# Altium schematic sheet Power_Stage.SchDoc
size A2; SheetNumber: 4; SheetTotal: 5
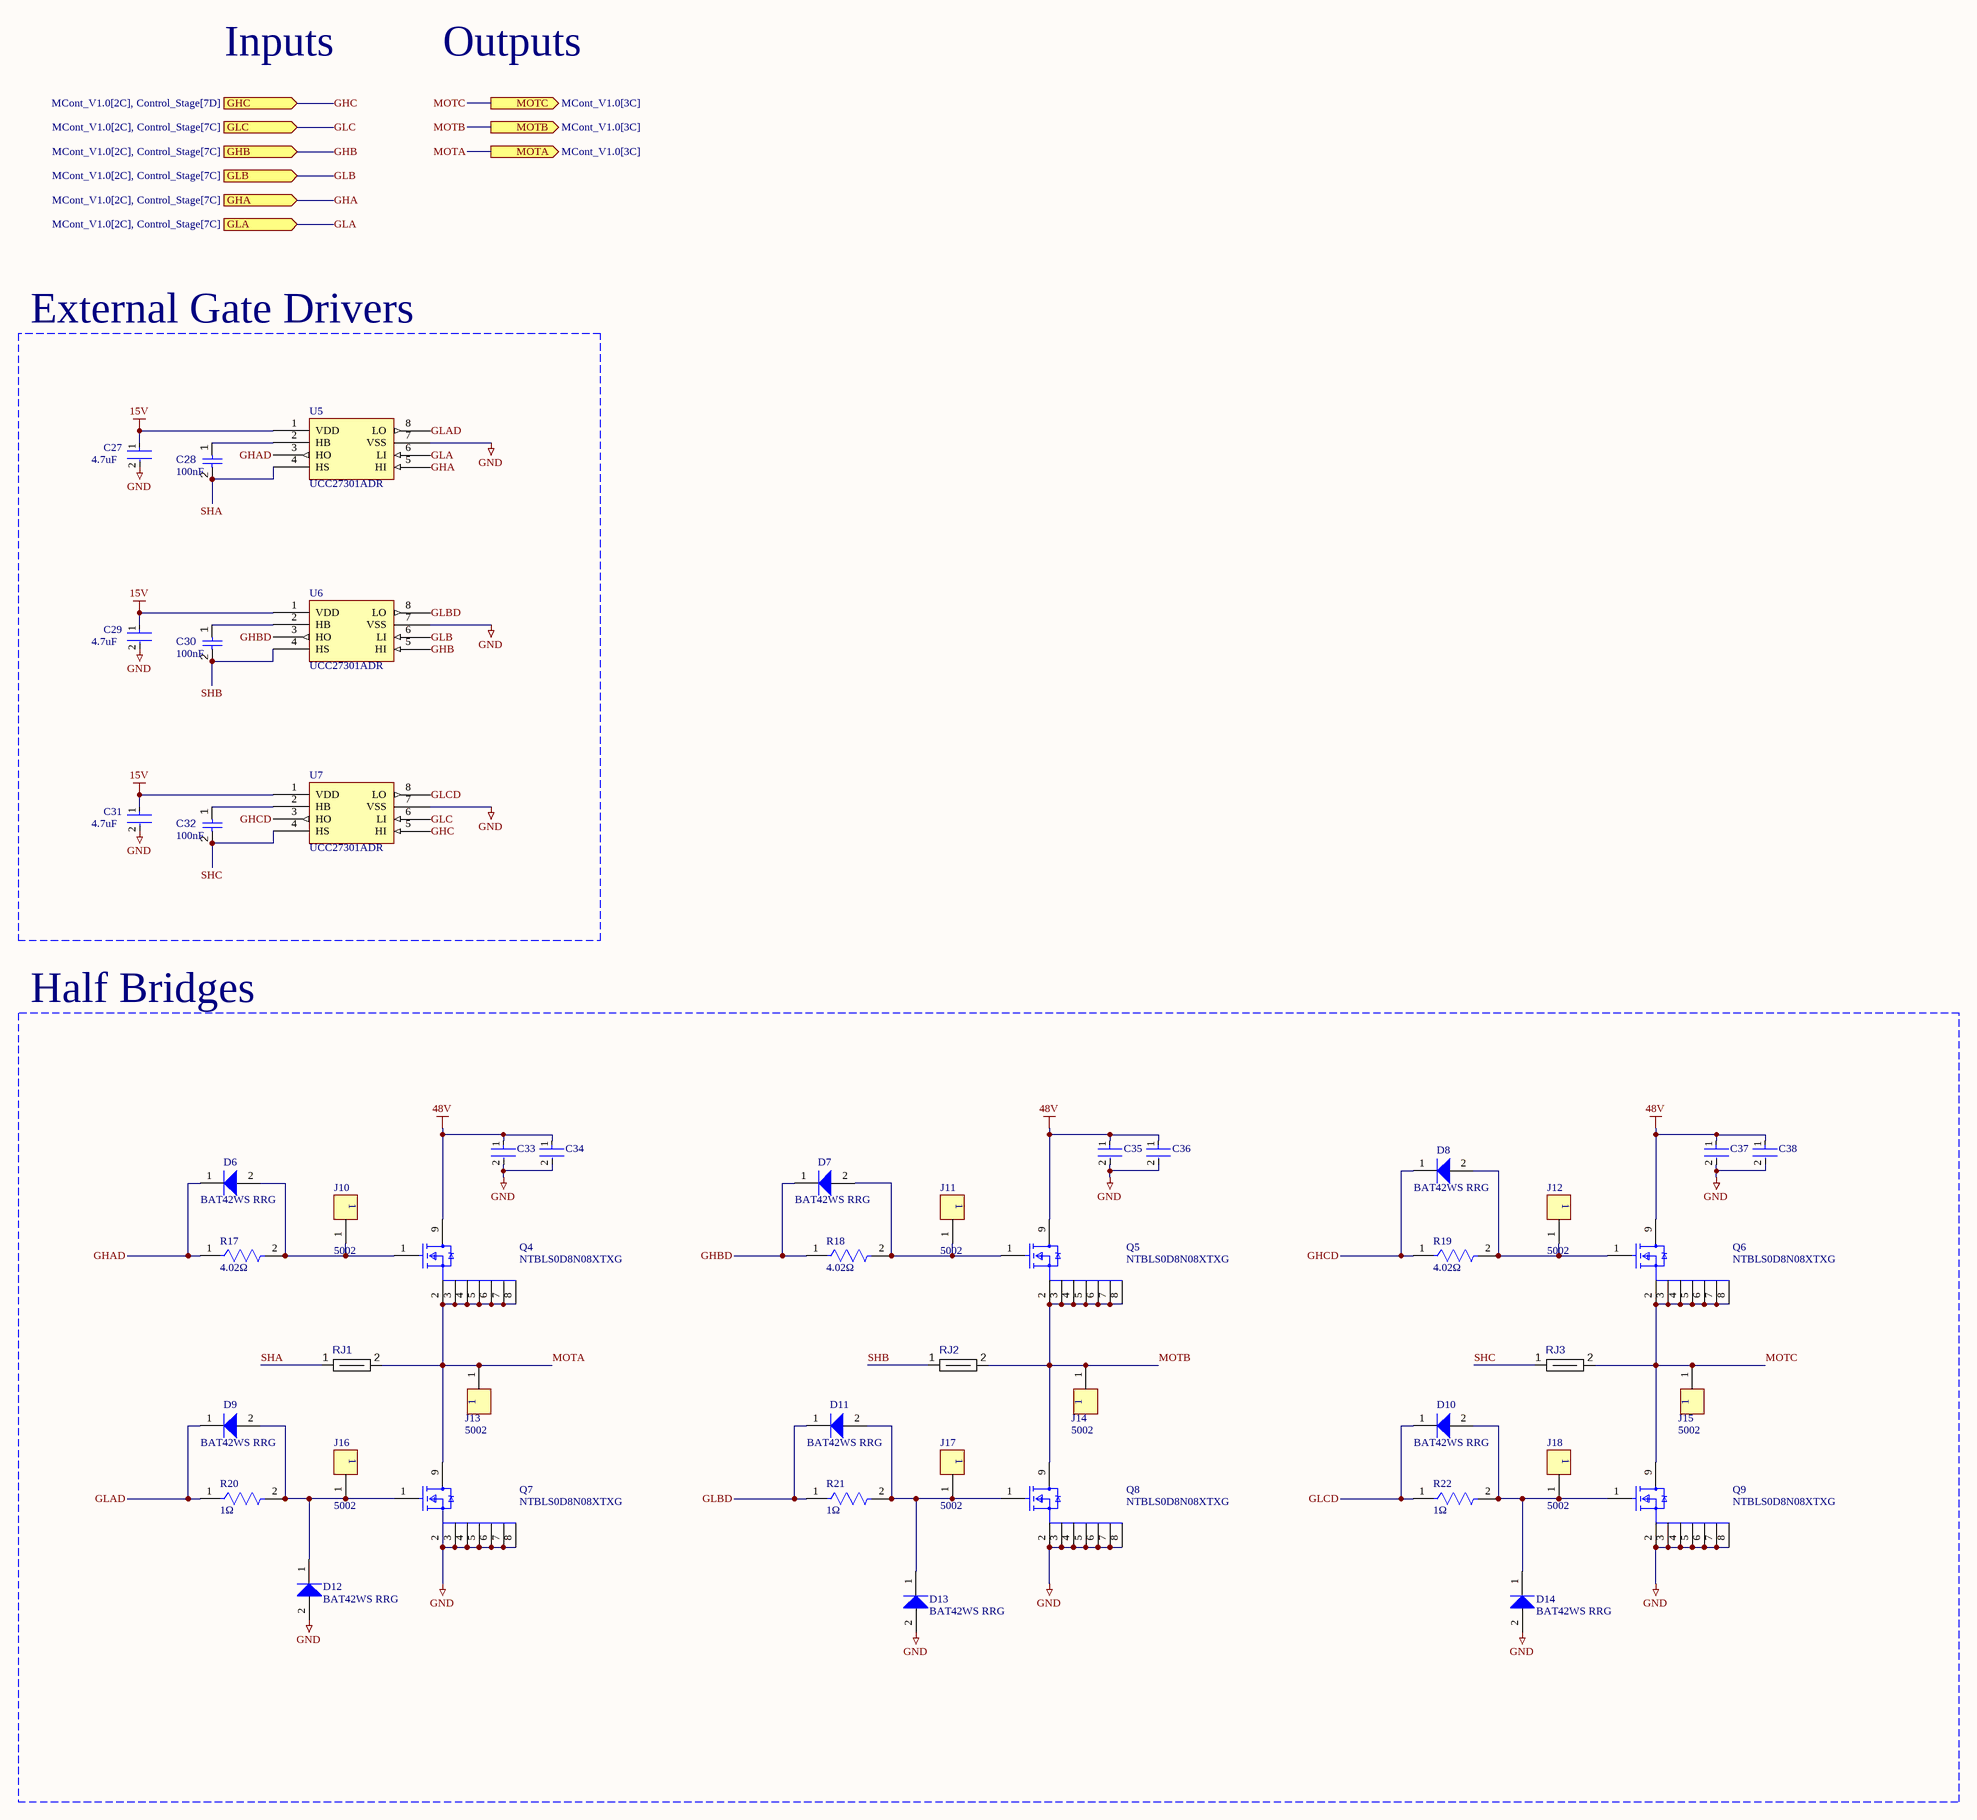
[diagram p0: Power_Stage.SchDoc]

## Parts
C27  Capacitance: 4.7uF  [FP-CL21-IPC_A]  (hidden comment: CL21A475KAQNNNE)
C28  value 100nF  [FP-CL10-IPC_B]  (hidden comment: CL10B104KC8NNNC)
C29  Capacitance: 4.7uF  [FP-CL21-IPC_A]  (hidden comment: CL21A475KAQNNNE)
C30  value 100nF  [FP-CL10-IPC_B]  (hidden comment: CL10B104KC8NNNC)
C31  Capacitance: 4.7uF  [FP-CL21-IPC_A]  (hidden comment: CL21A475KAQNNNE)
C32  value 100nF  [FP-CL10-IPC_B]  (hidden comment: CL10B104KC8NNNC)
C33  C1210C105K1RACTU  [FP-C1210C105K1RACTU-MFG]  (value not drawn)
C34  C1210C105K1RACTU  [FP-C1210C105K1RACTU-MFG]  (value not drawn)
C35  C1210C105K1RACTU  [FP-C1210C105K1RACTU-MFG]  (value not drawn)
C36  C1210C105K1RACTU  [FP-C1210C105K1RACTU-MFG]  (value not drawn)
C37  C1210C105K1RACTU  [FP-C1210C105K1RACTU-MFG]  (value not drawn)
C38  C1210C105K1RACTU  [FP-C1210C105K1RACTU-MFG]  (value not drawn)
D6  BAT42WS RRG  [BAT42WS RRG-Footprint-1]
D7  BAT42WS RRG  [BAT42WS RRG-Footprint-1]
D8  BAT42WS RRG  [BAT42WS RRG-Footprint-1]
D9  BAT42WS RRG  [BAT42WS RRG-Footprint-1]
D10  BAT42WS RRG  [BAT42WS RRG-Footprint-1]
D11  BAT42WS RRG  [BAT42WS RRG-Footprint-1]
D12  BAT42WS RRG  [BAT42WS RRG-Footprint-1]
D13  BAT42WS RRG  [BAT42WS RRG-Footprint-1]
D14  BAT42WS RRG  [BAT42WS RRG-Footprint-1]
J10  5002  [FP-5002-MFG]
J11  5002  [FP-5002-MFG]
J12  5002  [FP-5002-MFG]
J13  5002  [FP-5002-MFG]
J14  5002  [FP-5002-MFG]
J15  5002  [FP-5002-MFG]
J16  5002  [FP-5002-MFG]
J17  5002  [FP-5002-MFG]
J18  5002  [FP-5002-MFG]
Q4  NTBLS0D8N08XTXG  [NTBLS0D8N08XTXG]
Q5  NTBLS0D8N08XTXG  [NTBLS0D8N08XTXG]
Q6  NTBLS0D8N08XTXG  [NTBLS0D8N08XTXG]
Q7  NTBLS0D8N08XTXG  [NTBLS0D8N08XTXG]
Q8  NTBLS0D8N08XTXG  [NTBLS0D8N08XTXG]
Q9  NTBLS0D8N08XTXG  [NTBLS0D8N08XTXG]
R17  value 4.02Ω  [CRCW06034R02FKEAHP-Footprint-1]  (hidden comment: CRCW06034R02FKEAHP)
R18  value 4.02Ω  [CRCW06034R02FKEAHP-Footprint-1]  (hidden comment: CRCW06034R02FKEAHP)
R19  value 4.02Ω  [CRCW06034R02FKEAHP-Footprint-1]  (hidden comment: CRCW06034R02FKEAHP)
R20  value 1Ω  [SR0603FR-7T1RL-Footprint-1]  (hidden comment: SR0603FR-7T1RL)
R21  value 1Ω  [SR0603FR-7T1RL-Footprint-1]  (hidden comment: SR0603FR-7T1RL)
R22  value 1Ω  [SR0603FR-7T1RL-Footprint-1]  (hidden comment: SR0603FR-7T1RL)
RJ1  Net Tie 30x70mil  [Net Tie 10x20mil-Footprint-1]  (value not drawn)  (net tie, no BOM)
RJ2  Net Tie 30x70mil  [Net Tie 10x20mil-Footprint-1]  (value not drawn)  (net tie, no BOM)
RJ3  Net Tie 30x70mil  [Net Tie 10x20mil-Footprint-1]  (value not drawn)  (net tie, no BOM)
U5  UCC27301ADR  [SOIC127P600X175-8N]
U6  UCC27301ADR  [SOIC127P600X175-8N]
U7  UCC27301ADR  [SOIC127P600X175-8N]

## Blocks framed on the sheet
External Gate Drivers: C27-C32 U5-U7
Half Bridges: C33-C38 D6-D14 J10-J18 Q4-Q9 R17-R22 RJ1-RJ3

## Ports
GHA (in, see MCont_V1.0[2C], Control_Stage[7C]), GHB (in, see MCont_V1.0[2C], Control_Stage[7C]), GHC (in, see MCont_V1.0[2C], Control_Stage[7D]), GLA (in, see MCont_V1.0[2C], Control_Stage[7C]), GLB (in, see MCont_V1.0[2C], Control_Stage[7C]), GLC (in, see MCont_V1.0[2C], Control_Stage[7C]), MOTA (out, see MCont_V1.0[3C]), MOTB (out, see MCont_V1.0[3C]), MOTC (out, see MCont_V1.0[3C])

## Nets
15V: C27.1 C29.1 C31.1 U5.1(VDD) U6.1(VDD) U7.1(VDD)
48V: C33.1 C34.1 C35.1 C36.1 C37.1 C38.1 Q4.9(Drain) Q5.9(Drain) Q6.9(Drain)
GND: C27.2 C29.2 C31.2 C33.2 C34.2 C35.2 C36.2 C37.2 C38.2 D12.2(A) D13.2(A) D14.2(A) Q7.2(Source) Q7.3(Source) Q7.4(Source) Q7.5(Source) Q7.6(Source) Q7.7(Source) Q7.8(Source) Q8.2(Source) Q8.3(Source) Q8.4(Source) Q8.5(Source) Q8.6(Source) Q8.7(Source) Q8.8(Source) Q9.2(Source) Q9.3(Source) Q9.4(Source) Q9.5(Source) Q9.6(Source) Q9.7(Source) Q9.8(Source) U5.7(VSS) U6.7(VSS) U7.7(VSS)
GHA: U5.5(HI) ; port GHA
GHAD: D6.1(K) R17.1 U5.3(HO)
GHB: U6.5(HI) ; port GHB
GHBD: D7.1(K) R18.1 U6.3(HO)
GHC: U7.5(HI) ; port GHC
GHCD: D8.1(K) R19.1 U7.3(HO)
GLA: U5.6(LI) ; port GLA
GLAD: D9.1(K) R20.1 U5.8(LO)
GLB: U6.6(LI) ; port GLB
GLBD: D11.1(K) R21.1 U6.8(LO)
GLC: U7.6(LI) ; port GLC
GLCD: D10.1(K) R22.1 U7.8(LO)
MOTA: J13.1 Q4.2(Source) Q4.3(Source) Q4.4(Source) Q4.5(Source) Q4.6(Source) Q4.7(Source) Q4.8(Source) Q7.9(Drain) RJ1.2 ; port MOTA
MOTB: J14.1 Q5.2(Source) Q5.3(Source) Q5.4(Source) Q5.5(Source) Q5.6(Source) Q5.7(Source) Q5.8(Source) Q8.9(Drain) RJ2.2 ; port MOTB
MOTC: J15.1 Q6.2(Source) Q6.3(Source) Q6.4(Source) Q6.5(Source) Q6.6(Source) Q6.7(Source) Q6.8(Source) Q9.9(Drain) RJ3.2 ; port MOTC
SHA: C28.2 RJ1.1 U5.4(HS)
SHB: C30.2 RJ2.1 U6.4(HS)
SHC: C32.2 RJ3.1 U7.4(HS)
NetC28_1: C28.1 U5.2(HB)
NetC30_1: C30.1 U6.2(HB)
NetC32_1: C32.1 U7.2(HB)
NetD6_2: D6.2(A) J10.1 Q4.1(Gate) R17.2
NetD7_2: D7.2(A) J11.1 Q5.1(Gate) R18.2
NetD8_2: D8.2(A) J12.1 Q6.1(Gate) R19.2
NetD9_2: D9.2(A) D12.1(K) J16.1 Q7.1(Gate) R20.2
NetD10_2: D10.2(A) D14.1(K) J18.1 Q9.1(Gate) R22.2
NetD11_2: D11.2(A) D13.1(K) J17.1 Q8.1(Gate) R21.2

## Notes on the sheet
- Inputs
- Outputs

## Library data of the parts
C27 C29 C31 = CMP-13271-002624-1: CL21 Series 0805 4.7uF 25V ±10% Tolerance X5R Multilayer Ceramic Chip Capacitor; Case Code (Imperial): 0805; Thickness: 0.055inch; Mount: Surface Mount; Case Code (Metric): 2012; Depth: 1.25mm; Lead Free: Lead Free; Case/Package: 0805; Voltage Rating: 25V; Package Quantity: 1; Width: 0.049inch; Radiation Hardening: No; Voltage Rating (DC): 25V; Length: 2mm; Dielectric: X5R; Height: 1.25mm; Packaging: Tape and Reel; Tolerance: 10%; Min Operating Temperature: -55°C; Max Operating Temperature: 85°C
C28 C30 C32 = CMP-001-00090-1: Ceramic Capacitor, Multilayer, Ceramic, 100V, 10% +Tol, 10% -Tol, X7R, 15% TC, 0.1uF, Surface Mount, 0603; Case/Package: 0603; Min Operating Temperature: -55°C; Mounting Technology: Surface Mount; Capacitor Type: Ceramic; Max Operating Temperature: 125°C; Pins: 2; RoHS Compliant: Yes
C33-C38 = CMP-03020-034669-1: CAP CER 1UF 100V X7R 1210; Dielectric Material: Ceramic; Tolerance: 10%; Capacitance: 1uF; Height: 1.7mm; Voltage Rating: 100V; Termination: SMD/SMT; Depth: 2.5mm; Construction: Flat; REACH SVHC: No SVHC; Length: 3.2mm; Case Code (Imperial): 1210; Radiation Hardening: No; Case/Package: 1210; Case Code (Metric): 3225; Mount: Surface Mount; Package Quantity: 1; Voltage Rating (DC): 100V; Min Operating Temperature: -55°C; Voltage: 100V; Thickness: 0.075inch; Width: 0.098inch; Max Operating Temperature: 125°C; Packaging: Tape and Reel; Series: C; RoHS Compliant: Yes; Number of Pins: 2; Dielectric: X7R
D6-D14 = CMP-004-00032-1: Schottky Diode, 30V, 0.2A, Sod-323F Rohs Compliant: Yes; Manufacturer Lifecycle Status: ACTIVE; Lifecycle Status: Production
J10-J18 = CMP-2000-05182-2: PC TEST POINT MINIATURE WHITE; Body Material: Bronze; Insulation: Insulated; Inside Diameter: 1.27mm; Number of Ports: 1; Outside Diameter: 2.54mm; Hole Diameter: 1.6mm; Plating: Silver; Contact Plating: Silver; Orientation: Straight; REACH SVHC: No SVHC; Series: THM; Packaging: Bulk; Material: Nylon; Flammability Rating: UL94 V-0; Mount: Through Hole; Color: White; Housing Color: White; Length: 7.62mm; Contact Material: Bronze; Lead Free: Lead Free; Package Quantity: 100; RoHS Compliant: Yes
Q4-Q9 = CMP-013-00034-1: NTBL Series N-Channel 457A 325W Surface Mount Power Mosfet HPSOF-8; Manufacturer Lifecycle Status: ACTIVE; Lifecycle Status: Production; REACH SVHC: No; RoHS: Compliant
R17-R19 = CMP-009-00185-1: Res Thick Film 0603 4.02 Ohm 1% 0.33W(1/3W) ±100ppm/C Pad SMD Automotive T/R; Max Power Dissipation: 250mW; Voltage Rating: 75V; Power Dissipation: 330mW; Temperature Coefficient: 100ppm/°C; Tolerance: 1%; Packaging: Tape & Reel (TR); Number of Terminals: 2; Composition: Thick Film; REACH SVHC: Yes; Mounting Technology: Surface Mount; Lifecycle Status: Production; Length: 1.6002mm; Features: Automotive AEC-Q200; China RoHS: Non-Compliant; Export Control Classification Number (ECCN) Code: EAR99; Power Rating: 330mW; Introduction Date: 2008-07-29; Min Operating Temperature: -55°C; Harmonized Tariff Schedule (HTS) Code: 8533.21.00.30; Case Code (Metric): 1608; Height: 450µm; RoHS: Compliant; Case Code (Imperial): 0603; Contact Plating: Tin; Working Voltage: 75V; Case/Package: 0603; Number of Terminations: 2; Radiation Hardening: No; Lead Free: Lead Free; Width: 850µm; Max Operating Temperature: 155°C; Schedule B: 8533210045, 8533210045
R20-R22 = CMP-009-00184-1: Res Thick Film 0603 1 Ohm 1% 0.25W(1/4W) ±200ppm/C Pad SMD Automotive T/R; Working Voltage: 150V; Power Dissipation: 250mW; Temperature Coefficient: 200ppm/°C; Export Control Classification Number (ECCN) Code: EAR99; Harmonized Tariff Schedule (HTS) Code: 8533.21.00.30; Max Operating Temperature: 155°C; Mounting Technology: Surface Mount; Lifecycle Status: Production; Min Operating Temperature: -55°C; Height: 450µm; Introduction Date: 2017-10-02; Number of Terminals: 2; Width: 800µm; RoHS: Compliant; China RoHS: Non-Compliant; Case/Package: 0603; Tolerance: 1%; REACH SVHC: Yes; Packaging: Tape & Reel
RJ1-RJ3 = CMP-009-00182-13
U5-U7 = CMP-024-00000-1: 120V 4.5A half-bridge driver with 8V UVLO, interlock, and enable options 8-SOIC -40 to 150; Manufacturer Lifecycle Status: ACTIVE; Lifecycle Status: Production; RoHS: Compliant; Length: 4.9mm; Width: 3.91mm; Pins: 8; Height: 1.75mm; Thickness: 1.58mm; Case/Package: SOIC